# EAGLE schematic schematic (EAGLE 6.5.0)
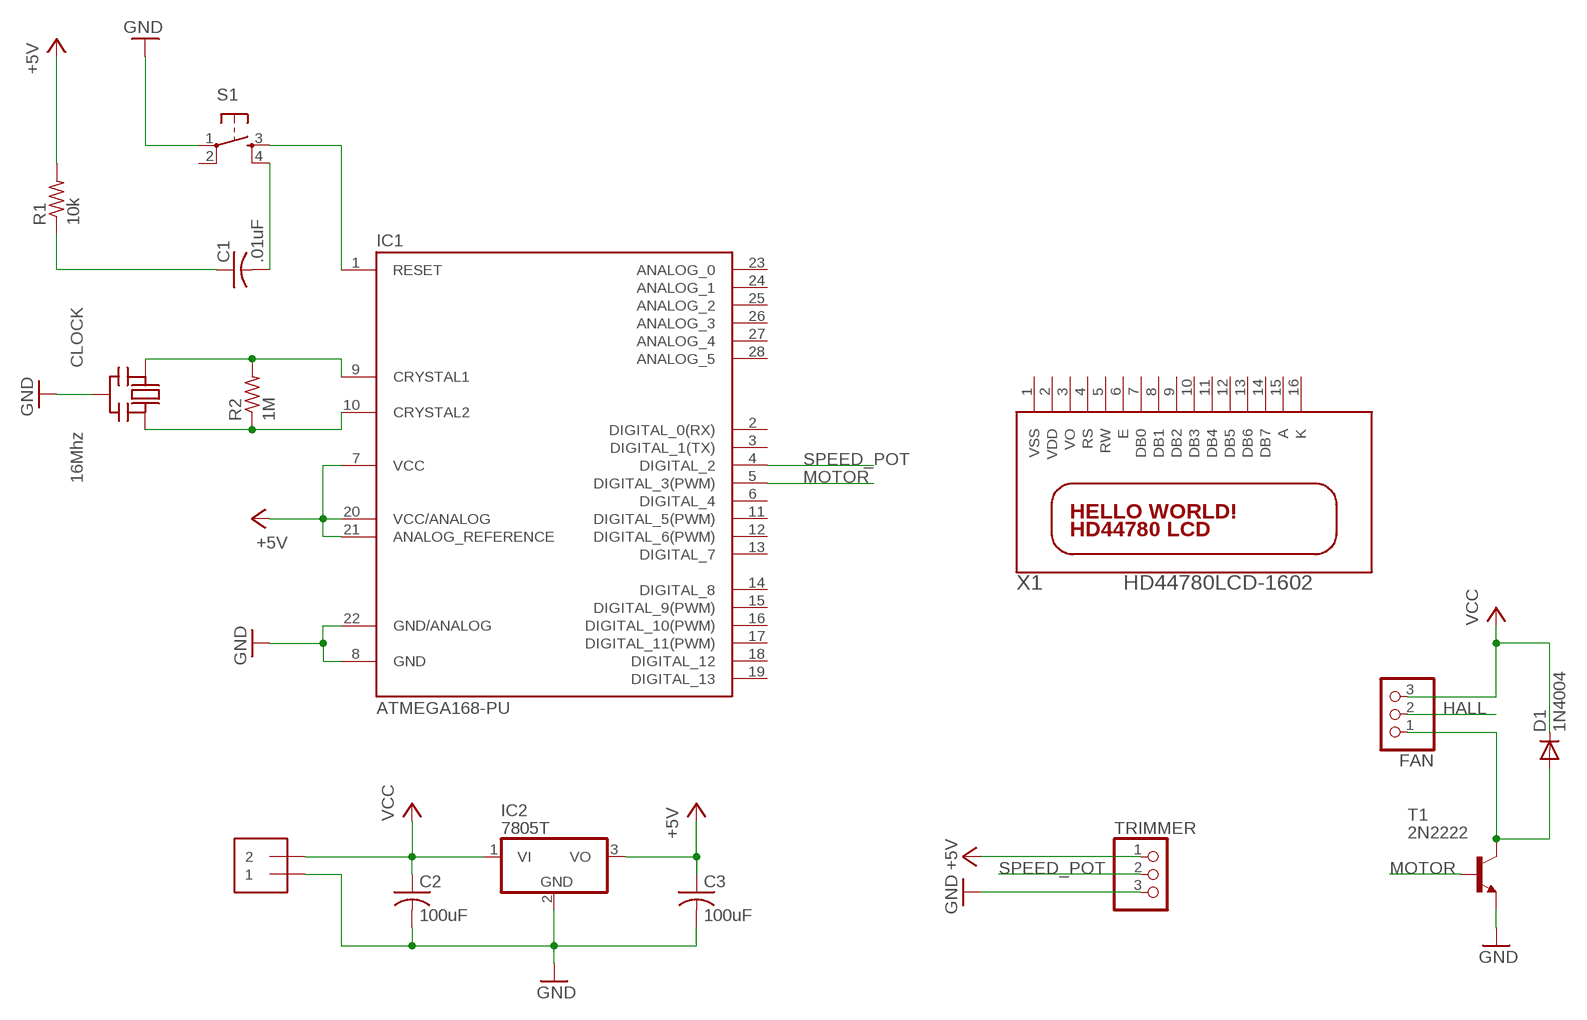
[diagram p0: schematic, sheet 1]

## Parts
C1  .01uF  C-US025-030X050  [C025-030X050]
C2  100uF  C-US025-030X050  [C025-030X050]
C3  100uF  C-US025-030X050  [C025-030X050]
CLOCK  16Mhz  CERMOSCILL-THM  [CERM_OSC]
D1  1N4004  [DO41-10]
FAN  PINHD-1X3CB  [1X03-CLEANBIG]
IC1  ATMEGA168-PU  [DIL28-3]
IC2  7805T  [TO220H]
POWER  1X2-3.5MM  [1X2-3.5MM]
R1  10k  R-US_0204/7  [0204/7]
R2  1M  R-US_0204/7  [0204/7]
S1  TAC_SWITCHPTH  [TACTILE-PTH]
T1  2N2222  [TO92-EBC-OVAL]
TRIMMER  PINHD-1X3  [1X03]
X1  HD44780LCD-1602  [LCD1602]

## Nets
+5V: C3.1 IC1.7(VCC) IC1.20(VCC/ANALOG) IC1.21(ANALOG_REFERENCE) IC2.3(VO) R1.2 TRIMMER.1
GND: C2.2 C3.2 CLOCK.P$2(GND) IC1.8(GND) IC1.22(GND/ANALOG) IC2.2(GND) POWER.1 S1.1 T1.E TRIMMER.3
HALL: FAN.2
MOTOR: IC1.5(DIGITAL_3(PWM)) T1.B
N$1: CLOCK.P$1(IN) IC1.9(CRYSTAL1) R2.2
N$2: CLOCK.P$3(OUT) IC1.10(CRYSTAL2) R2.1
N$3: C1.2 S1.4
N$4: IC1.1(RESET) S1.3
N$5: C1.1 R1.1
N$6: D1.A FAN.1 T1.C
SPEED_POT: IC1.4(DIGITAL_2) TRIMMER.2
VCC: C2.1 D1.C FAN.3 IC2.1(VI) POWER.2
Unconnected: IC1.2(DIGITAL_0(RX)) IC1.3(DIGITAL_1(TX)) IC1.6(DIGITAL_4) IC1.11(DIGITAL_5(PWM)) IC1.12(DIGITAL_6(PWM)) IC1.13(DIGITAL_7) IC1.14(DIGITAL_8) IC1.15(DIGITAL_9(PWM)) IC1.16(DIGITAL_10(PWM)) IC1.17(DIGITAL_11(PWM)) IC1.18(DIGITAL_12) IC1.19(DIGITAL_13) IC1.23(ANALOG_0) IC1.24(ANALOG_1) IC1.25(ANALOG_2) IC1.26(ANALOG_3) IC1.27(ANALOG_4) IC1.28(ANALOG_5) S1.2 X1.1(VSS) X1.2(VDD) X1.3(VO) X1.4(RS) X1.5(RW) X1.6(E) X1.7(DB0) X1.8(DB1) X1.9(DB2) X1.10(DB3) X1.11(DB4) X1.12(DB5) X1.13(DB6) X1.14(DB7) X1.15(A) X1.16(K)

## Library data of the parts
C1-C3 = adafruit:C-US: CAPACITOR, American symbol
CLOCK = adafruit:CERMOSCILL: Ceramic oscillator with built in capacitors such as ZTT-12MHz http://www.ladyada.net/library/eagle
D1 = adafruit:1N4004: DIODE General purpose 1N400x type rectifier (With bigger pads) http://www.ladyada.net/library/pcb/eaglelibrary.html
FAN TRIMMER = adafruit:PINHD-1X3: PIN HEADER
IC1 = Arduino-AVR:ATMEGA168-PU
IC2 = adafruit:78*: Positive VOLTAGE REGULATOR Added bigger pads to the TO-92 package
POWER = adafruit:1X2: 3.5mm Terminal block http://www.ladyada.net/library/pcb/eaglelibrary.html
R1 R2 = adafruit:R-US_: RESISTOR, American symbol
S1 = SparkFun-Electromechanical:TAC_SWITCH: Momentary Switch Button commonly used for reset or general input. Spark Fun Electronics SKU : COM-00097 SMT- SWCH-08247
T1 = adafruit:2N2222: NPN TRANSISTOR Big oval pads
X1 = adafruit:HD44780LCD: HD44780 LCD Standard character type LCDs, available in sizes from 8x1 to 40x4!